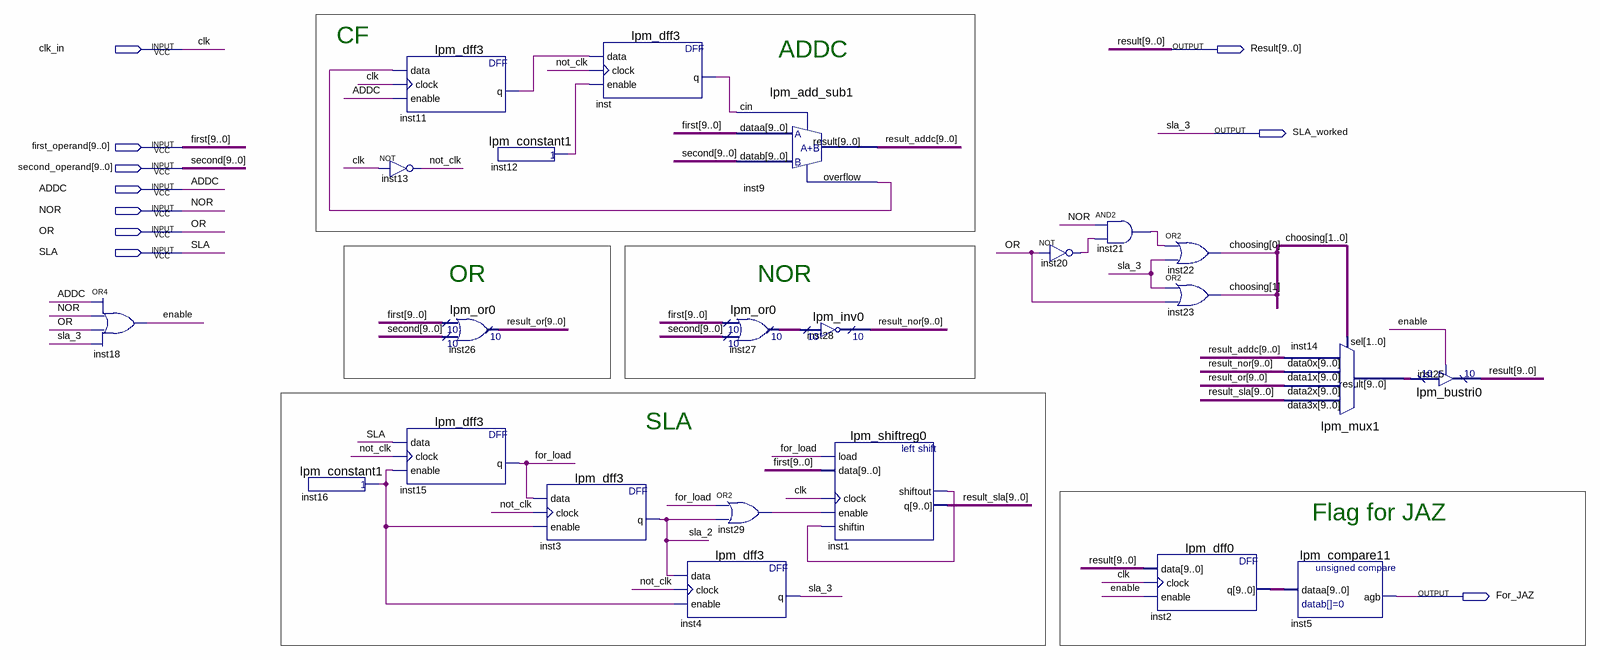
[diagram p0: schematic sheet]
// Quartus schematic ALU.bdf as structural Verilog: 23 symbols, 10 pins
module ALU (
  input  clk_in,
  input  [9:0] first_operand,
  input  [9:0] second_operand,
  input  ADDC,
  input  NOR,
  input  OR,
  input  SLA,
  output [9:0] Result,
  output SLA_worked,
  output For_JAZ
);

  wire enable, for_load, inst1_shiftout, inst9_overflow, inst11_q, inst12_result, inst16_result, inst20_out,
       inst21_out, inst29_out, inst_q, not_clk, sla_2;
  wire [1:0] choosing;
  wire [9:0] inst2_q, inst14_result, inst27_result, result_addc, result_nor, result_or, result_sla;

  or inst18 (enable, ADDC, NOR, OR, SLA_worked);
  lpm_constant1 inst16 (.result(inst16_result));
  lpm_dff3 inst11 (.data(inst9_overflow), .clock(clk_in), .enable(ADDC), .q(inst11_q));
  not inst13 (not_clk, clk_in);
  lpm_dff3 inst15 (.data(SLA), .clock(not_clk), .enable(inst16_result), .q(for_load));
  lpm_or0 inst26 (.data0x(first_operand), .data1x(second_operand), .result(result_or));
  lpm_constant1 inst12 (.result(inst12_result));
  lpm_dff3 inst3 (.data(for_load), .clock(not_clk), .enable(inst16_result), .q(sla_2));
  lpm_dff3 inst (.data(inst11_q), .clock(not_clk), .enable(inst12_result), .q(inst_q));
  lpm_dff3 inst4 (.data(sla_2), .clock(not_clk), .enable(inst16_result), .q(SLA_worked));
  lpm_add_sub1 inst9 (
    .dataa(first_operand), .datab(second_operand), .cin(inst_q), .result(result_addc),
    .overflow(inst9_overflow));
  lpm_or0 inst27 (.data0x(first_operand), .data1x(second_operand), .result(inst27_result));
  or inst29 (inst29_out, for_load, sla_2);
  lpm_inv0 inst28 (.data(inst27_result), .result(result_nor));
  lpm_shiftreg0 inst1 (
    .load(for_load), .data(first_operand), .clock(clk_in), .enable(inst29_out), .shiftin(inst1_shiftout),
    .shiftout(inst1_shiftout), .q(result_sla));
  not inst20 (inst20_out, OR);
  and inst21 (inst21_out, NOR, inst20_out);
  or inst22 (choosing[0], inst21_out, SLA_worked);
  or inst23 (choosing[1], SLA_worked, OR);
  lpm_dff0 inst2 (.data(Result), .clock(clk_in), .enable(enable), .q(inst2_q));
  lpm_mux1 inst14 (
    .data3x(result_sla), .data2x(result_or), .data1x(result_nor), .data0x(result_addc), .sel(choosing),
    .result(inst14_result));
  lpm_compare11 inst5 (.dataa(inst2_q), .agb(For_JAZ));
  lpm_bustri0 inst25 (.enabledt(enable), .data(inst14_result), .tridata(Result));

  // Other names for the same wires on the sheet: clk = clk_in; first[9:0] = first_operand;
  //   second[9:0] = second_operand; sla_3 = SLA_worked

  // Notes on the sheet:
  //   CF
  //   ADDC
  //   OR
  //   NOR
  //   SLA
  //   Flag for JAZ
endmodule
